# EAGLE design neoplate (EAGLE 9.4.2)
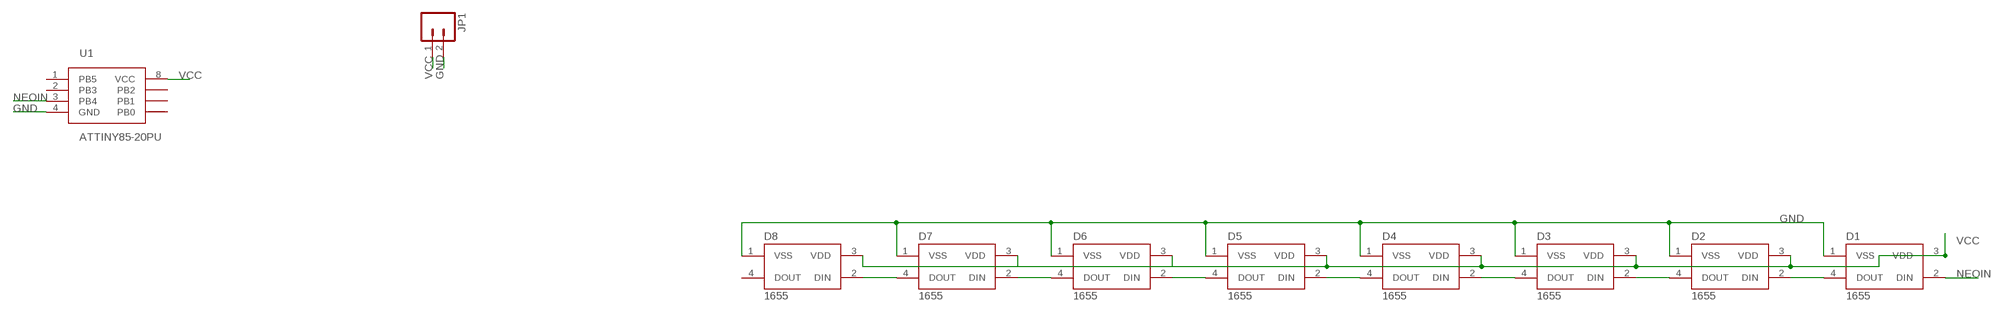
[diagram p0: schematic, sheet 1]

## Parts
D1  1655  [SMD_RGB]
D2  1655  [SMD_RGB]
D3  1655  [SMD_RGB]
D4  1655  [SMD_RGB]
D5  1655  [SMD_RGB]
D6  1655  [SMD_RGB]
D7  1655  [SMD_RGB]
D8  1655  [SMD_RGB]
JP1  M02PTH  [1X02]
U1  ATTINY85-20PU  [PDIP-8]

## Nets
GND: D1.1(VSS) D2.1(VSS) D3.1(VSS) D4.1(VSS) D5.1(VSS) D6.1(VSS) D7.1(VSS) D8.1(VSS) JP1.2 U1.4(GND)
N$1: D1.4(DOUT) D2.2(DIN)
N$2: D2.4(DOUT) D3.2(DIN)
N$3: D3.4(DOUT) D4.2(DIN)
N$4: D4.4(DOUT) D5.2(DIN)
N$5: D5.4(DOUT) D6.2(DIN)
N$6: D6.4(DOUT) D7.2(DIN)
N$7: D7.4(DOUT) D8.2(DIN)
NEOIN: D1.2(DIN) U1.3(PB4)
VCC: D1.3(VDD) D2.3(VDD) D3.3(VDD) D4.3(VDD) D5.3(VDD) D6.3(VDD) D7.3(VDD) D8.3(VDD) JP1.1 U1.8(VCC)
Unconnected: D8.4(DOUT) U1.1(PB5) U1.2(PB3) U1.5(PB0) U1.6(PB1) U1.7(PB2)

## Library data of the parts
D1-D8 = LED:1655: ADDRESS LED DISCR SER RGB 1=10 Manufacturer's datasheet <https://cdn-shop.adafruit.com/product-files/1138/SK6812+LED+datasheet+.pdf>; CREATED_BY: PCBLayout.com; DIGIKEY_PART_NUMBER: 1528-1104-ND; MANUFACTURER: Adafruit Industries LLC; MPN: WS2812B; OC_NEWARK: 43Y4720; PACKAGE: SMD
JP1 = SparkFun:M02: Header 2 Standard 2-pin 0.1" header. Use with straight break away headers (SKU : PRT-00116), right angle break away headers (PRT-00553), swiss pins (PRT-00743), machine pins (PRT-00117), and female headers (PRT-00115). Molex polarized connector foot print use with SKU : PRT-08233 with associated crimp pins and housings.; OC_NEWARK: unknown
U1 = Microcontroller:ATTINY85-20PU: IC MCU 8BIT 8KB FLASH 8DIP Manufacturer's datasheet <http://ww1.microchip.com/downloads/en/DeviceDoc/Atmel-2586-AVR-8-bit-Microcontroller-ATtiny25-ATtiny45-ATtiny85_Datasheet-Summary.pdf>; CREATED_BY: PCBLayout.com; DIGI_KEY_PART_NUMBER: ATTINY85-20PU-ND; MANUFACTURER: Microchip Technology; OC_NEWARK: unknown; PACKAGE: 8-PDIP

## Board
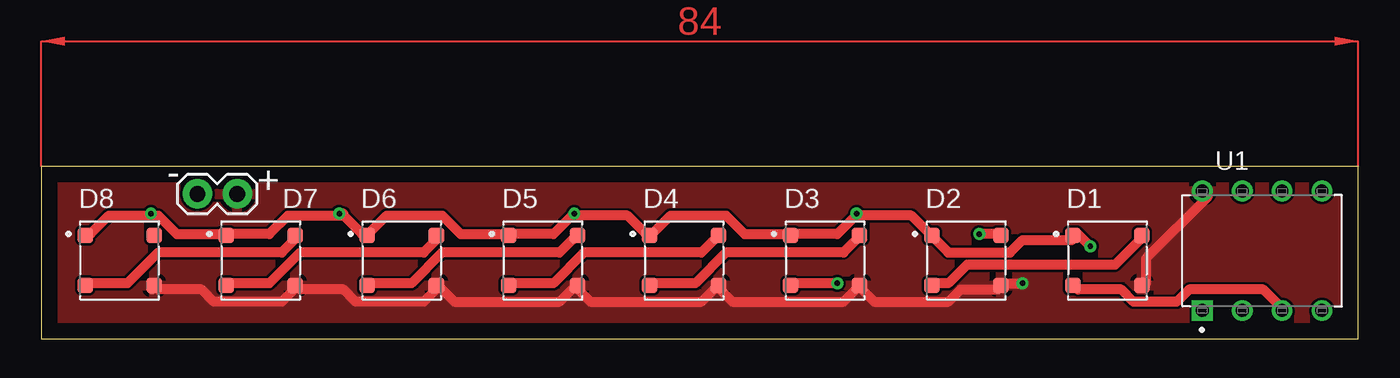
[diagram p1: board, top side]
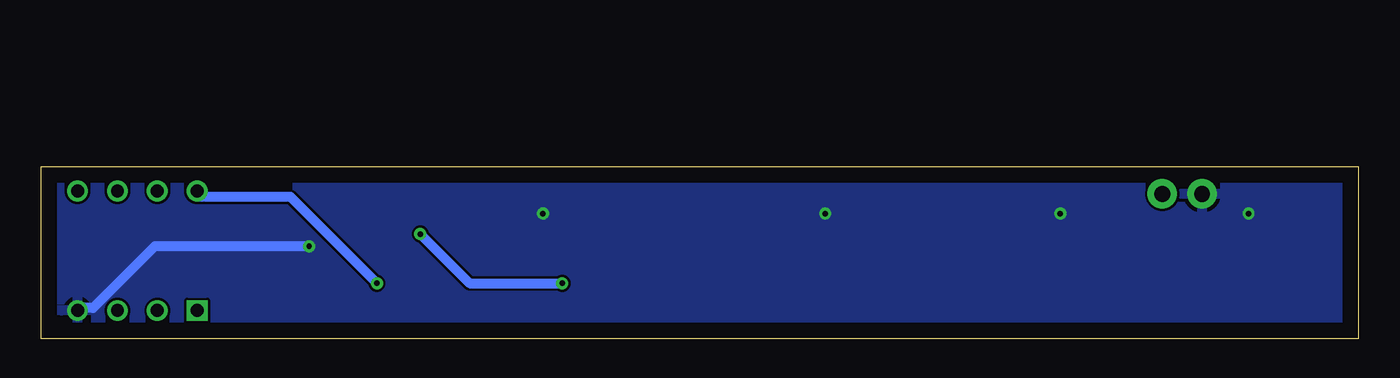
[diagram p2: board, bottom side, seen from below]

Size 84 x 11 mm. Coordinates in mm from the lower left corner, seen from the top.
Outline: 0,0 84,0 84,11 0,11 0,0
Copper layers (1*16): Top 0.035mm / dielectric 1.5mm / Bottom 0.035mm
Design rules "default *": minimum track width 25mil, minimum drill 0.35mm, track to track 6mil, track to pad 6mil, pad to pad 6mil, via to via 6mil, smd to smd 6mil, copper to edge 40mil, drill to drill 6mil, minimum pad ring 10mil, minimum via ring 8mil, stop-mask expansion 4mil, vias tented up to drill 0mil, thermal gap 10mil

### Footprints (pad centres in the part's own frame; a part is rotated, then mirrored left to right if it is on the bottom)
SMD_RGB = smd 1 x 1: 1 -2.2,1.6; 2 -2.2,-1.6; 3 2.2,-1.6; 4 2.2,1.6
1X02 = drill 1.016 pad 1.88: 1 0,0; 2 2.54,0
PDIP-8 = drill 0.813 pad 1.219 square: 1 -3.81,-3.81 | drill 0.813 pad 1.219: 2 -1.27,-3.81; 3 1.27,-3.81; 4 3.81,-3.81; 5 3.81,3.81; 6 1.27,3.81; 7 -1.27,3.81; 8 -3.81,3.81

### Placement (x,y rotation side)
D1  68,5 0 top
D2  59,5 0 top
D3  50,5 0 top
D4  41,5 0 top
D5  32,5 0 top
D6  23,5 0 top
D7  14,5 0 top
D8  5,5 0 top
JP1  12.5,9.25 180 top
U1  77.87,5.62 0 top

### Tracks (layer width: path | path; a pad name or v marks a point on that pad's centre or on a via)
GND  (via drill 0.35)
  Top 0.635: 51.95,7.87 50.77,6.69 48.02,6.69 D3.1 47.62,6.69 44.87,6.69 43.69,7.87 40.14,7.87 38.96,6.69 D4.1 38.57,6.69 37.39,7.87 34,7.87 | 51.95,7.87 55.5,7.87 56.68,6.69 D2.1 57.07,6.3 57.86,5.51 61.79,5.51 62.58,6.3 65.73,6.3 D1.1 66.13,6.69 v66.91,5.91 | 19.28,7.87 15.73,7.87 14.55,6.69 12.19,6.69 D7.1 11.8,6.69 8.64,6.69 7.46,7.87 7,7.87 | 19.28,7.87 20.46,6.69 D6.1 20.85,6.69 22.03,7.87 25.58,7.87 26.76,6.69 29.51,6.69 D5.1 29.91,6.69 32.66,6.69 33.84,7.87 34,7.87 | 2.74,6.69 D8.1 3.13,6.69 4.31,7.87 7,7.87 | 7,7.87 v7,8 | 19.28,7.87 19.28,8 v19,8 | 34,7.87 v34,8 | 51.95,7.87 51.95,8 v52,8
  Bottom 0.635: v66.91,5.91 76.76,5.91 80.69,1.97 81.48,1.97 U1.4
  pour Bottom: 0,11 84,11 84,0 0,0
N$1
  Top 0.635: D2.2 57.07,3.54 57.86,3.54 59.04,4.72 68.49,4.72 70.06,6.3 D1.4
N$2  (via drill 0.35)
  Top 0.635: v50.77,3.54 48.02,3.54 D3.2 | v59.83,6.69 61.01,6.69 D2.4
  Bottom 0.635: v50.77,3.54 56.68,3.54 v59.83,6.69
N$3
  Top 0.635: D4.2 38.96,3.54 41.72,3.54 43.69,5.51 51.17,5.51 51.95,6.3 D3.4
N$4
  Top 0.635: D5.2 29.91,3.54 32.66,3.54 34.63,5.51 42.11,5.51 42.9,6.3 D4.4
N$5
  Top 0.635: D6.2 20.85,3.54 23.61,3.54 25.58,5.51 33.06,5.51 33.84,6.3 D5.4
N$6
  Top 0.635: D7.2 12.19,3.54 14.55,3.54 16.52,5.51 24.39,5.51 25.18,6.3 D6.4
N$7
  Top 0.635: D8.2 3.13,3.54 5.5,3.54 7.46,5.51 15.34,5.51 16.13,6.3 D7.4
NEOIN
  Top 0.635: D1.2 66.13,3.15 68.88,3.15 69.67,2.36 72.43,2.36 73.21,3.15 77.94,3.15 79.12,1.97 U1.3
VCC  (via drill 0.35)
  Top 0.635: D1.3 70.46,3.54 70.46,5.12 74.39,9.05 U1.8 | 7.07,3.15 D8.3 7.46,3.15 10.22,3.15 11.01,2.36 15.34,2.36 16.13,3.15 D7.3 16.52,3.15 19.28,3.15 20.06,2.36 24.39,2.36 25.18,3.15 D6.3 25.58,3.15 26.36,2.36 33.06,2.36 33.84,3.15 D5.3 34.24,3.15 35.02,2.36 42.11,2.36 42.9,3.15 D4.3 43.29,3.15 44.08,2.36 51.17,2.36 51.95,3.15 D3.3 52.35,3.15 53.13,2.36 57.86,2.36 58.65,3.15 61.01,3.15 D2.3 61.4,3.54 v62.58,3.54
  Bottom 0.635: 12.61,9.05 JP1.1 | v62.58,3.54 68.09,9.05 74,9.05 U1.8
  pour Top: 0,11 84,11 84,0 0,0
(copper drawn outside any net)
  shapes: Top area x2

### Text on the board
tNames: - | +